# Altium schematic sheet 第六届省赛原理图.SchDoc
size A4
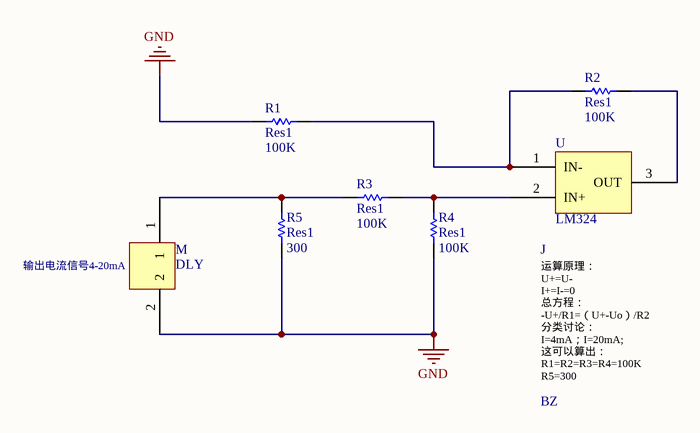
[diagram p0: 第六届省赛原理图.SchDoc]

## Parts
J  BZ
M  DLY
R1  Res1  value 100K  [AXIAL-0.3]
R2  Res1  value 100K  [AXIAL-0.3]
R3  Res1  value 100K  [AXIAL-0.3]
R4  Res1  value 100K  [AXIAL-0.3]
R5  Res1  value 300  [AXIAL-0.3]
U  LM324

## Nets
GND: M.2 R1.2 R4.1 R5.1
VCC: U.4(VCC) U.5(GND)
NetM_1: M.1 R3.2 R5.2
NetR1_1: R1.1 R2.2 U.1(IN-)
NetR2_1: R2.1 U.3(OUT)
NetR3_1: R3.1 R4.2 U.2(IN+)

## Notes on the sheet
- (in symbol BZ) 运算原理： / U+=U- / I+=I-=0 / 总方程： / -U+/R1=（U+-Uo）/R2 / 分类讨论： / I=4mA；I=20mA; / 这可以算出： / R1=R2=R3=R4=100K / R5=300
- (in symbol DLY) 输出电流信号4-20mA

## Library data of the parts
R1-R5 = Res1: Resistor; Published: 8-Jun-2000; LatestRevisionDate: 17-Jul-2002; LatestRevisionNote: Re-released for DXP Platform.; PackageReference: AXIAL-0.3; Publisher: Altium Limited